# Altium schematic sheet LED_Channel.SchDoc
size Letter; Organization: Cegep Limoilou; Address1: 1300, 8e Avenue; Address2: Québec, QC; Address3: Canada; Address4: G1J 5L5; Revision: A; SheetNumber: 4; SheetTotal: 6; Conception: Thomas Lajoie; Titre: LED Channel; Modification: TL
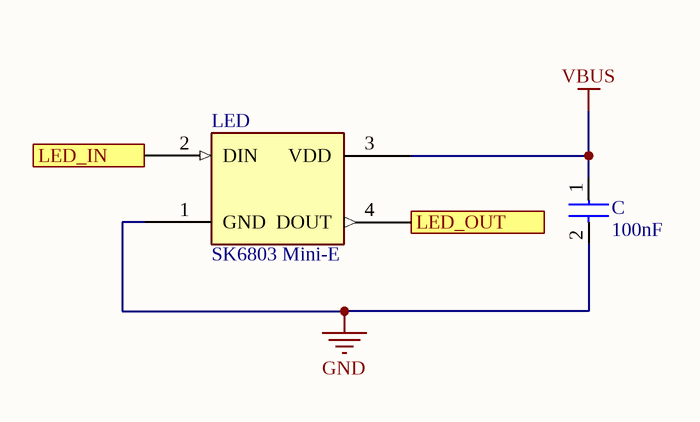
[diagram p0: LED_Channel.SchDoc]

## Parts
C  100nF  [CL10B104KA8NNNC]
LED  SK6803 Mini-E  [SK6803 MINI-E]

## Ports
LED_IN (in), LED_OUT (out)

## Nets
GND: C.2 LED.1(GND)
VBUS: C.1 LED.3(VDD)
LED_IN: LED.2(DIN) ; port LED_IN
LED_OUT: LED.4(DOUT) ; port LED_OUT

## Notes on the sheet
- Titre :
- Conception :
- Date :
- Modification :
- Heure :
- Révision :
- Feuille
- de
- Fichier :

## Library data of the parts
C = CAP NP: LCSC Part #: C1590